# Altium schematic sheet zytek_ctl.SchDoc
size A3; DocumentNumber: 1; SheetNumber: 1; SheetTotal: 4
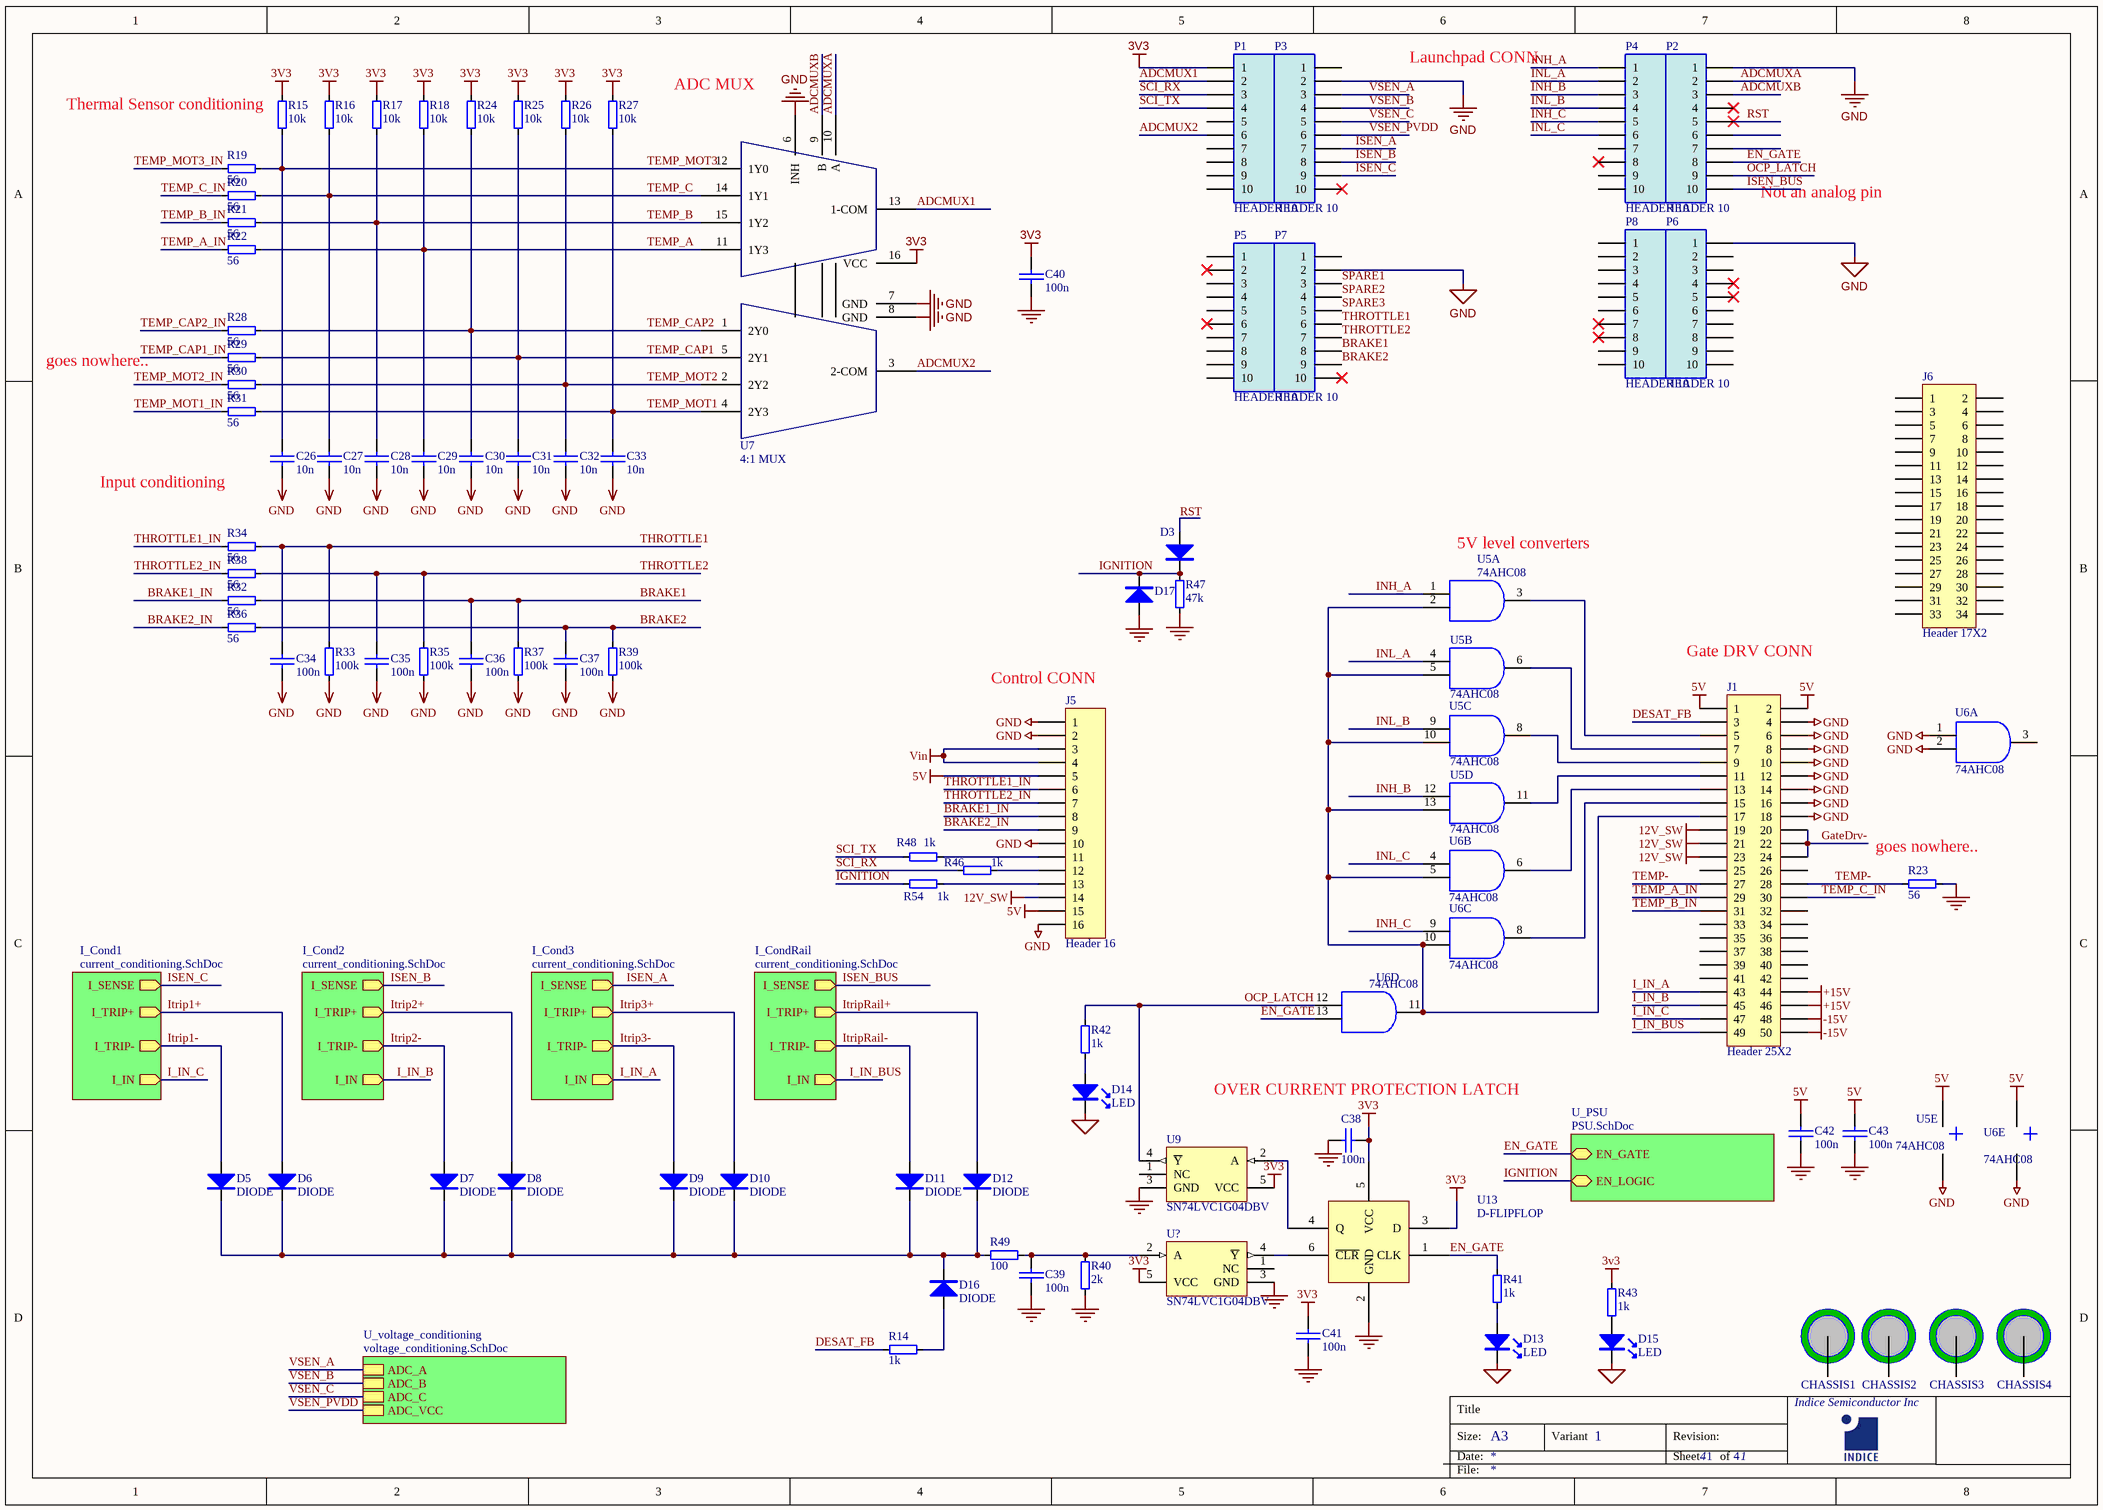
[diagram p0: zytek_ctl.SchDoc]

## Parts
C26  10n  [0603]
C27  10n  [0603]
C28  10n  [0603]
C29  10n  [0603]
C30  10n  [0603]
C31  10n  [0603]
C32  10n  [0603]
C33  10n  [0603]
C34  100n  [0603]
C35  100n  [0603]
C36  100n  [0603]
C37  100n  [0603]
C38  100n  [0603]
C39  100n  [0603]
C40  100n  [0603]
C41  100n  [0603]
C42  100n  [0603]
C43  100n  [0603]
CHASSIS1  M2.0  [M4.0]  (value not drawn)  (no BOM)
CHASSIS2  M2.0  [M4.0]  (value not drawn)  (no BOM)
CHASSIS3  M2.0  [M4.0]  (value not drawn)  (no BOM)
CHASSIS4  M2.0  [M4.0]  (value not drawn)  (no BOM)
D3  (no value)  [SOD323-AK]
D5  DIODE  [D-0603]
D6  DIODE  [D-0603]
D7  DIODE  [D-0603]
D8  DIODE  [D-0603]
D9  DIODE  [D-0603]
D10  DIODE  [D-0603]
D11  DIODE  [D-0603]
D12  DIODE  [D-0603]
D13  LED  [0603_LED]
D14  LED  [0603_LED]
D15  LED  [0603_LED]
D16  DIODE  [D-0603]
D17  (no value)  [SOD323-AK]
J1  Header 25X2  [HDR2X20_2mm]
J5  Header 16  [HDR1X16]
J6  Header 17X2  [HDR2X17_2mm]
P1  HEADER 10  [HDR10]
P2  HEADER 10  [HDR10]
P3  HEADER 10  [HDR10]
P4  HEADER 10  [HDR10]
P5  HEADER 10  [HDR10]
P6  HEADER 10  [HDR10]
P7  HEADER 10  [HDR10]
P8  HEADER 10  [HDR10]
R14  1k  [0603]
R15  10k  [0603]
R16  10k  [0603]
R17  10k  [0603]
R18  10k  [0603]
R19  56  [0603]
R20  56  [0603]
R21  56  [0603]
R22  56  [0603]
R23  56  [0603]
R24  10k  [0603]
R25  10k  [0603]
R26  10k  [0603]
R27  10k  [0603]
R28  56  [0603]
R29  56  [0603]
R30  56  [0603]
R31  56  [0603]
R32  56  [0603]
R33  100k  [0603]
R34  56  [0603]
R35  100k  [0603]
R36  56  [0603]
R37  100k  [0603]
R38  56  [0603]
R39  100k  [0603]
R40  2k  [0603]
R41  1k  [0603]
R42  1k  [0603]
R43  1k  [0603]
R46  1k  [0603]
R47  47k  [0805]
R48  1k  [0603]
R49  100  [0603]
R54  1k  [0603]
U5  74AHC08  [SOIC14]  (parts A,B,C,D,E of 5)
U6  74AHC08  (parts A,B,C,D,E of 5)
U7  4:1 MUX  [SOIC16]
U9  SN74LVC1G04DBV  [SOT23-5]
U13  D-FLIPFLOP  [SOT23-6]
U?  SN74LVC1G04DBV  [SOT23-5]

## Sub-sheets
I_Cond1 = current_conditioning.SchDoc: I_SENSE (out), I_TRIP+ (out), I_TRIP- (out), I_IN (out)
I_Cond2 = current_conditioning.SchDoc: I_SENSE (out), I_TRIP+ (out), I_TRIP- (out), I_IN (out)
I_Cond3 = current_conditioning.SchDoc: I_SENSE (out), I_TRIP+ (out), I_TRIP- (out), I_IN (out)
I_CondRail = current_conditioning.SchDoc: I_SENSE (out), I_TRIP+ (out), I_TRIP- (out), I_IN (out)
U_PSU = PSU.SchDoc: EN_GATE, EN_LOGIC
U_voltage_conditioning = voltage_conditioning.SchDoc: ADC_A, ADC_B, ADC_C, ADC_VCC

## Nets
3v3: C38.1 C40.1 C41.1 P1.1 R15.2 R16.2 R17.2 R18.2 R24.2 R25.2 R26.2 R27.2 R43.2 U7.16(VCC) U9.5(VCC) U13.3(D) U13.5(VCC) U?.5(VCC)
5V: C42.1 C43.1 J1.1 J1.2 J5.5 J5.15 U5.14(Vcc) U6.14(Vcc)
12V_SW: J1.19 J1.21 J1.23 J5.14
+15V: J1.44 J1.46
-15V: J1.48 J1.50
GND: C26.2 C27.2 C28.2 C29.2 C30.2 C31.2 C32.2 C33.2 C34.2 C35.2 C36.2 C37.2 C38.2 C39.2 C40.2 C41.2 C42.2 C43.2 D13.2(K) D14.2(K) D15.2(K) D17.A J1.4 J1.6 J1.8 J1.10 J1.12 J1.14 J1.16 J1.18 J5.1 J5.2 J5.10 J5.16 P2.1 P3.2 P6.1 P7.2 R23.2 R33.1 R35.1 R37.1 R39.1 R40.2 R47.2 U5.7(GND) U6.1(1A) U6.2(1B) U6.7(GND) U7.6(INH) U7.7(GND) U7.8(GND) U9.3(GND) U13.2(GND) U?.3(GND)
Vin: J5.3 J5.4
ADCMUX1: P1.2 U7.13(1-COM)
ADCMUX2: P1.6 U7.3(2-COM)
ADCMUXA: P2.2 U7.10(A)
ADCMUXB: P2.3 U7.9(B)
BRAKE1: C36.1 P7.8 R32.2 R37.2
BRAKE1_IN: J5.8 R32.1
BRAKE2: C37.1 P7.9 R36.2 R39.2
BRAKE2_IN: J5.9 R36.1
DESAT_FB: J1.3 R14.2
EN_GATE: P2.8 R41.2 U6.13(4B) U13.1(CLK) ; sheet U_PSU/EN_GATE
GateDrv-: J1.20 J1.22 J1.24
I_IN_A: J1.43 ; sheet I_Cond3/I_IN
I_IN_B: J1.45 ; sheet I_Cond2/I_IN
I_IN_BUS: J1.49 ; sheet I_CondRail/I_IN
I_IN_C: J1.47 ; sheet I_Cond1/I_IN
IGNITION: D3.K D17.K R47.1 R54.1 ; sheet U_PSU/EN_LOGIC
INH_A: P4.1 U5.1(1A)
INH_B: P4.3 U5.12(4A)
INH_C: P4.5 U6.9(3A)
INL_A: P4.2 U5.4(2A)
INL_B: P4.4 U5.9(3A)
INL_C: P4.6 U6.4(2A)
ISEN_A: P3.7 ; sheet I_Cond3/I_SENSE
ISEN_B: P3.8 ; sheet I_Cond2/I_SENSE
ISEN_BUS: P2.10 ; sheet I_CondRail/I_SENSE
ISEN_C: P3.9 ; sheet I_Cond1/I_SENSE
Itrip1+: D6.A ; sheet I_Cond1/I_TRIP+
Itrip1-: D5.A ; sheet I_Cond1/I_TRIP-
Itrip2+: D8.A ; sheet I_Cond2/I_TRIP+
Itrip2-: D7.A ; sheet I_Cond2/I_TRIP-
Itrip3+: D10.A ; sheet I_Cond3/I_TRIP+
Itrip3-: D9.A ; sheet I_Cond3/I_TRIP-
ItripRail+: D12.A ; sheet I_CondRail/I_TRIP+
ItripRail-: D11.A ; sheet I_CondRail/I_TRIP-
OCP_LATCH: P2.9 R42.2 U6.12(4A) U9.4(~{Y})
RST: D3.A P2.5
SCI_RX: P1.3 R46.1
SCI_TX: P1.4 R48.1
SPARE1: P7.3
SPARE2: P7.4
SPARE3: P7.5
TEMP-: J1.27 J1.28 R23.1
TEMP_A: C29.1 R18.1 R22.2 U7.11(1Y3)
TEMP_A_IN: J1.29 R22.1
TEMP_B: C28.1 R17.1 R21.2 U7.15(1Y2)
TEMP_B_IN: J1.31 R21.1
TEMP_C: C27.1 R16.1 R20.2 U7.14(1Y1)
TEMP_C_IN: J1.30 R20.1
TEMP_CAP1: C31.1 R25.1 R29.2 U7.5(2Y1)
TEMP_CAP1_IN: R29.1
TEMP_CAP2: C30.1 R24.1 R28.2 U7.1(2Y0)
TEMP_CAP2_IN: R28.1
TEMP_MOT1: C33.1 R27.1 R31.2 U7.4(2Y3)
TEMP_MOT1_IN: R31.1
TEMP_MOT2: C32.1 R26.1 R30.2 U7.2(2Y2)
TEMP_MOT2_IN: R30.1
TEMP_MOT3: C26.1 R15.1 R19.2 U7.12(1Y0)
TEMP_MOT3_IN: R19.1
THROTTLE1: C34.1 P7.6 R33.2 R34.2
THROTTLE1_IN: J5.6 R34.1
THROTTLE2: C35.1 P7.7 R35.2 R38.2
THROTTLE2_IN: J5.7 R38.1
VSEN_A: P3.3 ; sheet U_voltage_conditioning/ADC_A
VSEN_B: P3.4 ; sheet U_voltage_conditioning/ADC_B
VSEN_C: P3.5 ; sheet U_voltage_conditioning/ADC_C
VSEN_PVDD: P3.6 ; sheet U_voltage_conditioning/ADC_VCC
NetC39_1: C39.1 R40.1 R49.2 U?.2(A)
NetD5_K: D5.K D6.K D7.K D8.K D9.K D10.K D11.K D12.K D16.K R49.1
NetD13_1: D13.1(A) R41.1
NetD14_1: D14.1(A) R42.1
NetD15_1: D15.1(A) R43.1
NetD16_A: D16.A R14.1
NetJ1_5: J1.5 U5.3(1Y)
NetJ1_7: J1.7 U5.6(2Y)
NetJ1_9: J1.9 U5.8(3Y)
NetJ1_11: J1.11 U5.11(4Y)
NetJ1_13: J1.13 U6.6(2Y)
NetJ1_15: J1.15 U6.8(3Y)
NetJ1_17: J1.17 U5.2(1B) U5.5(2B) U5.10(3B) U5.13(4B) U6.5(2B) U6.10(3B) U6.11(4Y)
NetJ5_11: J5.11 R48.2
NetJ5_12: J5.12 R46.2
NetJ5_13: J5.13 R54.2
NetU9_2: U9.2(A) U13.4(Q)
NetU13_6: U13.6(~{CLR}) U?.4(~{Y})

Not connected (* = marked no-connect by the designer): CHASSIS1 1; CHASSIS2 1; CHASSIS3 1; CHASSIS4 1; J1 25 26 32 33 34 35 36 37 38 39 40 41 42; J6 1 2 3 4 5 6 7 8 9 10 11 12 13 14 15 16 17 18 19 20 21 22 23 24 25 26 27 28 29 30 31 32 33 34; P1 5 7 8 9 10; P2 4* 6 7; P3 1 10*; P4 7 8* 9 10; P5 1 2* 3 4 5 6* 7 8 9 10; P6 2 3 4* 5* 6 7 8 9 10; P7 1 10*; P8 1 2 3 4 5 6 7* 8* 9 10; U6 3(1Y); U9 1(NC); U? 1(NC)

## Notes on the sheet
- (near R15) Thermal Sensor conditioning
- ADC MUX
- Launchpad CONN
- Not an analog pin
- goes nowhere..
- (near C26) Input conditioning
- (near U5) 5V level converters
- (near J5) Control CONN
- (near J1) Gate DRV CONN
- (near R23) goes nowhere..
- OVER CURRENT PROTECTION LATCH
- Title
- Size:
- Date:
- A3
- Variant
- Revision:
- Sheet
- of
- Indice Semiconductor Inc
- File:

## Library data of the parts
C26-C43 = CAP: Capacitor; Status: Draft
CHASSIS1-CHASSIS4 = M2.0_HOLE: 2.0mm Hole
D3 D17 = DIODE: Parameter: Signal, >=200mA, SOD323, Vr>=75V; Status: Draft
D13-D15 = LED: pin to pad: 1>A 2>K
J1 = Header 25X2: Header, 25-Pin, Dual row; LatestRevisionDate: 17-Jul-2002; LatestRevisionNote: Re-released for DXP Platform.; Publisher: Altium Limited
J5 = Header 16: Header, 16-Pin; LatestRevisionDate: 17-Jul-2002; LatestRevisionNote: Re-released for DXP Platform.; Publisher: Altium Limited
J6 = Header 17X2: Header, 17-Pin, Dual row; LatestRevisionDate: 17-Jul-2002; LatestRevisionNote: Re-released for DXP Platform.; Publisher: Altium Limited
P1-P8 = HEADER 10: 12 Pin Header; Status: Draft
R14 R19-R22 R28-R40 R49 = RES4: Parameter: 1%, Thick or Metal Film, 63mW
R15-R18 R24-R27 = RES4: Resistor; Parameter: *; Status: Draft
R23 R41-R43 R46 R48 R54 = RESISTOR: Parameter: *; Status: Draft
R47 = RESISTOR: Parameter: <1%, Thick film, 63mW; Status: Draft
U5 U6 = 74AHC08_QUAD_AND: Quad AND Gate
U7 = SN74LV4052A
U9 U? = CMP-0441-00001-1: Single Inverter Gate SOT-553; Manufacturer: Texas Instruments; Supply Voltage: 1.65 to 5.5 V; ComponentLink3URL: http://www.ti.com/litv/pdf/mpds018i; DatasheetVersion: SCES214Z, 11/2012; ComponentLink2URL: http://www.ti.com/lit/ds/symlink/sn74lvc1g04.pdf; Mounting Technology: Surface Mount; PackageDescription: 5-Pin Plastic Small Outline, Body 1.6 Ã— 2.9 mm, Pitch 0.95 mm; PackageVersion: 4073253-4/K, 03/2006; PackageReference: DBV5; Storage Temperature: -65 to 150 degC; ComponentLink3Description: Package Specification; ComponentLink2Description: Datasheet; Ambient Temperature: -40 to 85 degC; PartNumber: SN74LVC1G04DBV; ComponentLink1Description: Manufacturer URL; ComponentLink1URL: http://www.ti.com/
U13 = D-FLIPFLOP: With reset; Manufacturer 1: TI SN74LVC1G175; Digikey: 296-17617-1-ND
D5-D12 D16 = DIODE: Status: Draft